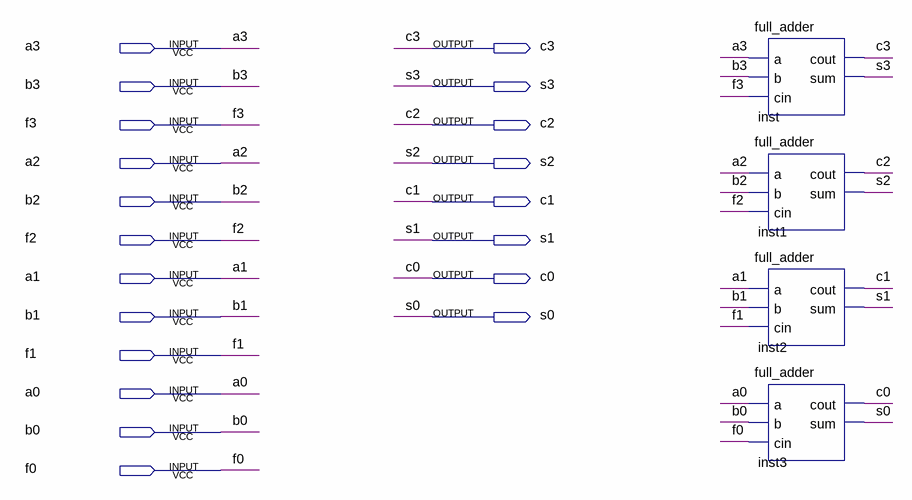
[diagram p0: schematic sheet]
// Quartus schematic carrysaveadder_pins.bdf as structural Verilog: 4 symbols, 20 pins
module carrysaveadder_pins (
  input  a3,
  input  b3,
  input  f3,
  input  a2,
  input  b2,
  input  f2,
  input  a1,
  input  b1,
  input  f1,
  input  a0,
  input  b0,
  input  f0,
  output c3,
  output s3,
  output c2,
  output s2,
  output c1,
  output s1,
  output c0,
  output s0
);

  full_adder inst (.a(a3), .b(b3), .cin(f3), .cout(c3), .sum(s3));
  full_adder inst1 (.a(a2), .b(b2), .cin(f2), .cout(c2), .sum(s2));
  full_adder inst2 (.a(a1), .b(b1), .cin(f1), .cout(c1), .sum(s1));
  full_adder inst3 (.a(a0), .b(b0), .cin(f0), .cout(c0), .sum(s0));
endmodule
